# Altium schematic sheet Display.SchDoc: 7-SEGMENT DISPLAY & DRIVER
size A4; SheetNumber: 2; SheetTotal: 5; DOC_NO_SCH_DWG: #032024040601
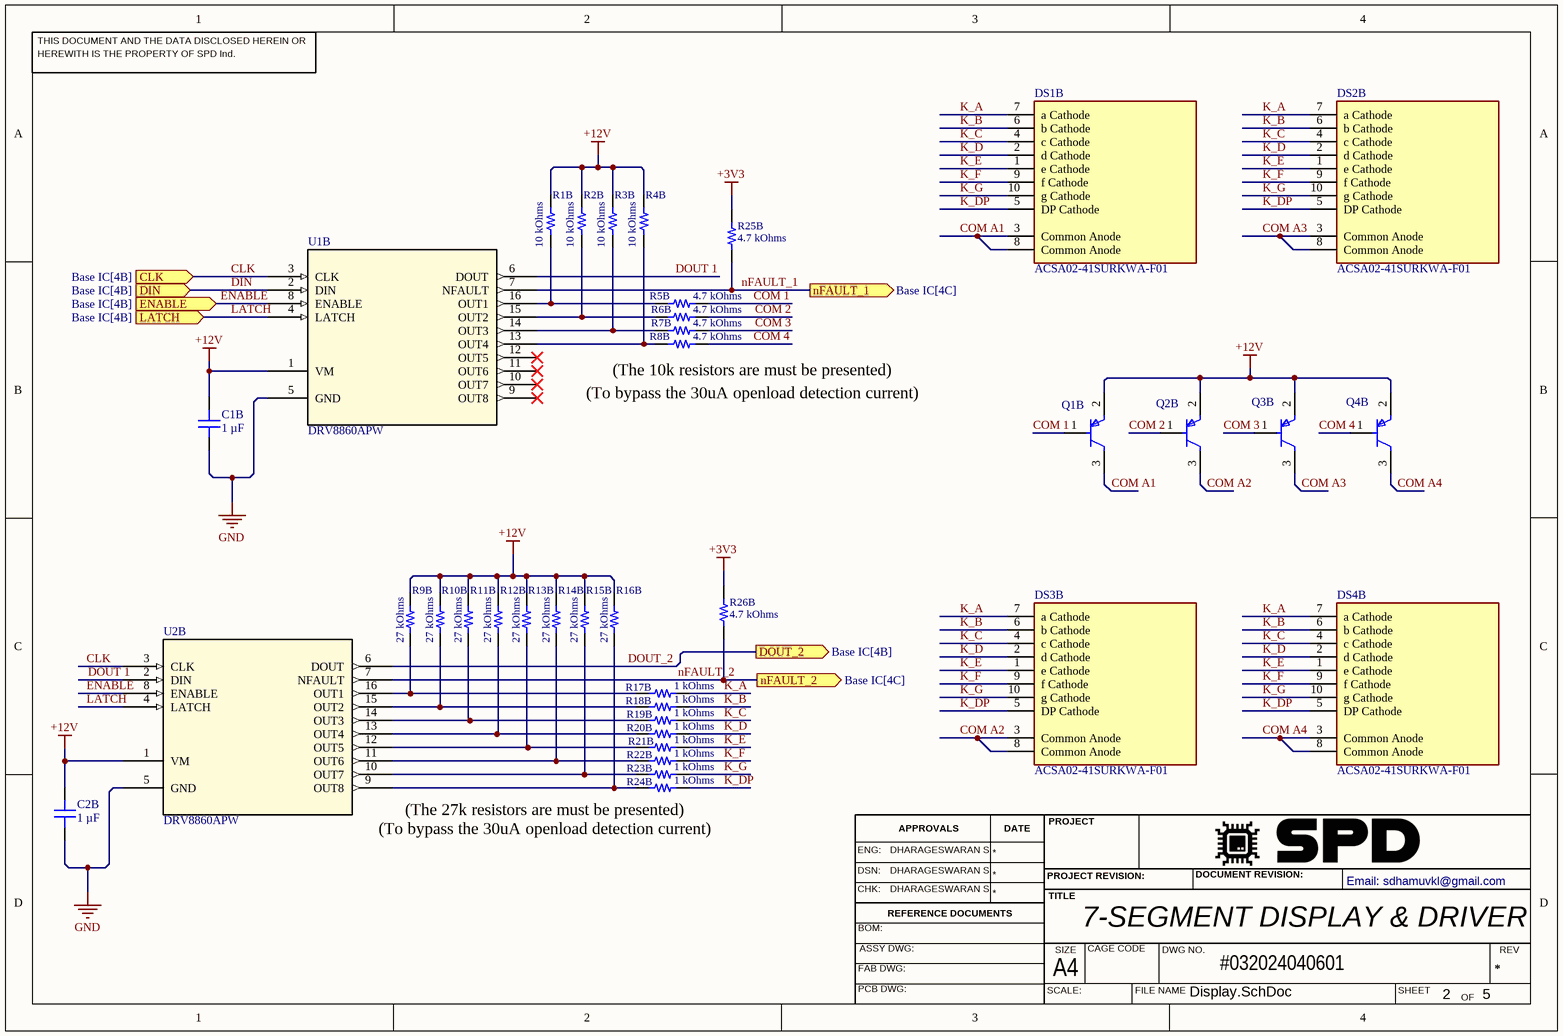
[diagram p0: Display.SchDoc]

## Parts
C1B  1 µF  [CAP 0402_1005]
C2B  1 µF  [CAP 0402_1005]
DS1B  ACSA02-41SURKWA-F01  [FP-ACSA02-41SURKWA-F01-MFG]
DS2B  ACSA02-41SURKWA-F01  [FP-ACSA02-41SURKWA-F01-MFG]
DS3B  ACSA02-41SURKWA-F01  [FP-ACSA02-41SURKWA-F01-MFG]
DS4B  ACSA02-41SURKWA-F01  [FP-ACSA02-41SURKWA-F01-MFG]
Q1B  MMBT3906FZ-7B  [FP-X2-DFN0606-3-MFG]  (value not drawn)
Q2B  MMBT3906FZ-7B  [FP-X2-DFN0606-3-MFG]  (value not drawn)
Q3B  MMBT3906FZ-7B  [FP-X2-DFN0606-3-MFG]  (value not drawn)
Q4B  MMBT3906FZ-7B  [FP-X2-DFN0606-3-MFG]  (value not drawn)
R1B  10 kOhms  [RES 0402_1005]
R2B  10 kOhms  [RES 0402_1005]
R3B  10 kOhms  [RES 0402_1005]
R4B  10 kOhms  [RES 0402_1005]
R5B  4.7 kOhms  [RES 0402_1005]
R6B  4.7 kOhms  [RES 0402_1005]
R7B  4.7 kOhms  [RES 0402_1005]
R8B  4.7 kOhms  [RES 0402_1005]
R9B  27 kOhms  [RES 0402_1005]
R10B  27 kOhms  [RES 0402_1005]
R11B  27 kOhms  [RES 0402_1005]
R12B  27 kOhms  [RES 0402_1005]
R13B  27 kOhms  [RES 0402_1005]
R14B  27 kOhms  [RES 0402_1005]
R15B  27 kOhms  [RES 0402_1005]
R16B  27 kOhms  [RES 0402_1005]
R17B  1 kOhms  [RES 0402_1005]
R18B  1 kOhms  [RES 0402_1005]
R19B  1 kOhms  [RES 0402_1005]
R20B  1 kOhms  [RES 0402_1005]
R21B  1 kOhms  [RES 0402_1005]
R22B  1 kOhms  [RES 0402_1005]
R23B  1 kOhms  [RES 0402_1005]
R24B  1 kOhms  [RES 0402_1005]
R25B  4.7 kOhms  [RES 0402_1005]
R26B  4.7 kOhms  [RES 0402_1005]
U1B  DRV8860APW  [PW_16]
U2B  DRV8860APW  [PW_16]

## Ports
CLK (in, see Base IC[4B]), DIN (in, see Base IC[4B]), DOUT_2 (out, see Base IC[4B]), ENABLE (in, see Base IC[4B]), LATCH (in, see Base IC[4B]), nFAULT_1 (out, see Base IC[4C]), nFAULT_2 (out, see Base IC[4C])

## Nets
+3V3: R25B.2 R26B.2
+12V: C1B.1 C2B.1 Q1B.2(E) Q2B.2(E) Q3B.2(E) Q4B.2(E) R1B.2 R2B.2 R3B.2 R4B.2 R9B.2 R10B.2 R11B.2 R12B.2 R13B.2 R14B.2 R15B.2 R16B.2 U1B.1(VM) U2B.1(VM)
GND: C1B.2 C2B.2 U1B.5(GND) U2B.5(GND)
CLK: U1B.3(CLK) U2B.3(CLK) ; port CLK
COM 1: Q1B.1(B) R5B.2
COM 2: Q2B.1(B) R6B.2
COM 3: Q3B.1(B) R7B.2
COM 4: Q4B.1(B) R8B.2
COM A1: DS1B.3(Common_Anode) DS1B.8(Common_Anode) Q1B.3(C)
COM A2: DS3B.3(Common_Anode) DS3B.8(Common_Anode) Q2B.3(C)
COM A3: DS2B.3(Common_Anode) DS2B.8(Common_Anode) Q3B.3(C)
COM A4: DS4B.3(Common_Anode) DS4B.8(Common_Anode) Q4B.3(C)
DIN: U1B.2(DIN) ; port DIN
DOUT 1: U1B.6(DOUT) U2B.2(DIN)
DOUT_2: U2B.6(DOUT) ; port DOUT_2
ENABLE: U1B.8(ENABLE) U2B.8(ENABLE) ; port ENABLE
K_A: DS1B.7(a_Cathode) DS2B.7(a_Cathode) DS3B.7(a_Cathode) DS4B.7(a_Cathode) R17B.2
K_B: DS1B.6(b_Cathode) DS2B.6(b_Cathode) DS3B.6(b_Cathode) DS4B.6(b_Cathode) R18B.2
K_C: DS1B.4(c_Cathode) DS2B.4(c_Cathode) DS3B.4(c_Cathode) DS4B.4(c_Cathode) R19B.2
K_D: DS1B.2(d_Cathode) DS2B.2(d_Cathode) DS3B.2(d_Cathode) DS4B.2(d_Cathode) R20B.2
K_DP: DS1B.5(DP_Cathode) DS2B.5(DP_Cathode) DS3B.5(DP_Cathode) DS4B.5(DP_Cathode) R24B.2
K_E: DS1B.1(e_Cathode) DS2B.1(e_Cathode) DS3B.1(e_Cathode) DS4B.1(e_Cathode) R21B.2
K_F: DS1B.9(f_Cathode) DS2B.9(f_Cathode) DS3B.9(f_Cathode) DS4B.9(f_Cathode) R22B.2
K_G: DS1B.10(g_Cathode) DS2B.10(g_Cathode) DS3B.10(g_Cathode) DS4B.10(g_Cathode) R23B.2
LATCH: U1B.4(LATCH) U2B.4(LATCH) ; port LATCH
nFAULT_1: R25B.1 U1B.7(NFAULT) ; port nFAULT_1
nFAULT_2: R26B.1 U2B.7(NFAULT) ; port nFAULT_2
NetR1B_1: R1B.1 R5B.1 U1B.16(OUT1)
NetR2B_1: R2B.1 R6B.1 U1B.15(OUT2)
NetR3B_1: R3B.1 R7B.1 U1B.14(OUT3)
NetR4B_1: R4B.1 R8B.1 U1B.13(OUT4)
NetR9B_1: R9B.1 R17B.1 U2B.16(OUT1)
NetR10B_1: R10B.1 R18B.1 U2B.15(OUT2)
NetR11B_1: R11B.1 R19B.1 U2B.14(OUT3)
NetR12B_1: R12B.1 R20B.1 U2B.13(OUT4)
NetR13B_1: R13B.1 R21B.1 U2B.12(OUT5)
NetR14B_1: R14B.1 R22B.1 U2B.11(OUT6)
NetR15B_1: R15B.1 R23B.1 U2B.10(OUT7)
NetR16B_1: R16B.1 R24B.1 U2B.9(OUT8)

Not connected (* = marked no-connect by the designer): U1B 9(OUT8)* 10(OUT7)* 11(OUT6)* 12(OUT5)*

## Notes on the sheet
- (near R8B) (The 10k resistors are must be presented)
- (To bypass the 30uA openload detection current)
- (near R24B) (The 27k resistors are must be presented)
- THIS DOCUMENT AND THE DATA DISCLOSED HEREIN OR
- HEREWITH IS THE PROPERTY OF SPD Ind.
- ENG:
- DHARAGESWARAN S
- APPROVALS
- DATE
- PROJECT
- DSN:
- CHK:
- REFERENCE DOCUMENTS
- PROJECT REVISION:
- TITLE
- DOCUMENT REVISION:
- Email: sdhamuvkl@gmail.com <https://github.com/DhamuVkl>
- BOM:
- FAB DWG:
- PCB DWG:
- ASSY DWG:
- SCALE:
- A4
- SIZE
- CAGE CODE
- FILE NAME
- DWG NO.
- SHEET
- REV
- OF

## Library data of the parts
C1B C2B = GRM155C81C105KE15J: CAP CER MLCC; Manufacturer: Murata Electronics; id: 7124; Temperature Coefficient: X6S; Tolerance: ±10%; Voltage - Rated: 16V; Part Number: GRM155C81C105KE15J; Value: 1 µF; Supplier Part Number 1: 490-GRM155C81C105KE15JCT-ND; ComponentLink2Description: DigiKey Link; PartId: 54559; Supplier 1: DigiKey; Series: GRM; LastUpdated: 2023-06-29T19:02:33.680; Part Status: Active; Capacitance: 1 µF; Device Package: 0402 (1005 Metric); Thickness (Max): 0.022" (0.55mm); Minimum Order: 1; Packaging: CutTape; Applications: General Purpose; Package / Case: 0402 (1005 Metric); Price: 0.01; ComponentLink2URL: https://www.digikey.com/en/products/detail/murata-electronics/GRM155C81C105KE15J/10697200; Lifecycle Status: Active; Operating Temperature: -55°C ~ 105°C; Size / Dimension: 0.039" L x 0.020" W (1.00mm x 0.50mm); Mounting Type: Surface Mount, MLCC
DS1B DS2B DS3B DS4B = CMP-44525-000003-1: DISPLAY 7-SEG 0.2" SGL RED 10SMD; Element Configuration: Common Anode; Forward Current: 30mA; Wavelength: 630nm; Operating Supply Voltage: 1.95V; Number of Characters: 1; Max Power Dissipation: 75mW; Luminous Intensity: 30mcd; Test Current: 20mA; Package Quantity: 650; Width: 0.272inch; Max Operating Temperature: 85°C; Case/Package: SMD/SMT; Illumination Color: Red; Min Operating Temperature: -40°C; Packaging: Tape and Reel; Power Consumption: 75mW; Forward Voltage: 1.95V; Color: Red; Height: 0.315inch
Q1B Q2B Q3B Q4B = CMP-12798-000043-1: TRANS PNP 40V 0.2A X2-DFN060; Continuous Collector Current: -200mA; Gain Bandwidth Product: 250MHz; Collector Base Voltage (VCBO): -40V; Emitter Base Voltage (VEBO): -6V; Element Configuration: Single; hFE Min: 100; Max Power Dissipation: 435mW; Collector Emitter Voltage (VCEO): 400mV; Collector Emitter Saturation Voltage: -400mV; Transition Frequency: 280MHz; Max Collector Current: 200mA; Mount: Surface Mount; Polarity: PNP; Min Operating Temperature: -55°C; Max Operating Temperature: 150°C; Package Quantity: 10000; Max Breakdown Voltage: 40V; Collector Emitter Breakdown Voltage: 40V; Packaging: Tape and Reel; Number of Pins: 3
R1B R2B R3B R4B = AA0402FR-0710KL: RES SMD 10K OHM 1% 1/16W 0402; Manufacturer: Yageo; id: 10610; Temperature Coefficient: ±150ppm/°C; Power (Watts): 0.063W, 1/16W; Part Number: AA0402FR-0710KL; Height - Seated (Max): 0.015" (0.37mm); Supplier Part Number 1: 13-AA0402FR-0710KLCT-ND; Supplier Device Package: 0402; ComponentLink1Description: Datasheet; ComponentLink2URL: https://www.digikey.com/en/products/detail/yageo/AA0402FR-0710KL/5887729; Features: Anti-Sulfur, Automotive AEC-Q200, Moisture Resistant; ComponentLink1URL: https://www.yageo.com/upload/media/product/productsearch/datasheet/rchip/PYu-AA_51_RoHS_L_3.pdf; Composition: Thick Film; Tolerance: ±1%; Supplier 1: DigiKey; Series: AA; Part Status: Active; ComponentLink2Description: DigiKey Link; Device Package: 0402 (1005 Metric); Packaging: TapeAndReel; Ratings: AEC-Q200; Minimum Order: 1; Package / Case: 0402 (1005 Metric); PartId: 59190; Lifecycle Status: Active; LastUpdated: 2023-01-02T20:20:10.303; Operating Temperature: -55°C ~ 155°C; Number Of Terminations: 2; Value: 10 kOhms; Size / Dimension: 0.039" L x 0.020" W (1.00mm x 0.50mm); Price: 0.01; Resistance: 10 kOhms
R5B R6B R7B R8B R25B R26B = AC0402FR-074K7L: RES SMD 4.7K OHM 1% 1/16W 0402; Manufacturer: Yageo; id: 4996; Temperature Coefficient: ±100ppm/°C; Power (Watts): 0.063W, 1/16W; Part Number: AC0402FR-074K7L; Height - Seated (Max): 0.015" (0.37mm); Supplier Part Number 1: YAG3497CT-ND; Supplier Device Package: 0402; ComponentLink1Description: Datasheet; ComponentLink2URL: https://www.digikey.com/en/products/detail/yageo/AC0402FR-074K7L/5895396; Features: Automotive AEC-Q200, Moisture Resistant; ComponentLink1URL: https://www.yageo.com/upload/media/product/productsearch/datasheet/rchip/PYu-AC_51_RoHS_L_7.pdf; Composition: Thick Film; Tolerance: ±1%; Supplier 1: DigiKey; Series: AC; Part Status: Active; ComponentLink2Description: DigiKey Link; Device Package: 0402 (1005 Metric); Packaging: CutTape; Ratings: AEC-Q200; Minimum Order: 1; Package / Case: 0402 (1005 Metric); PartId: 12051; Lifecycle Status: Active; LastUpdated: 2023-01-02T20:21:09.847; Operating Temperature: -55°C ~ 155°C; Number Of Terminations: 2; Value: 4.7 kOhms; Size / Dimension: 0.039" L x 0.020" W (1.00mm x 0.50mm); Price: 0.01; Resistance: 4.7 kOhms
R9B R10B R11B R12B R13B R14B R15B R16B = AC0402FR-0727KL: RES SMD 27K OHM 1% 1/16W 0402; Manufacturer: Yageo; id: 5006; Temperature Coefficient: ±100ppm/°C; Power (Watts): 0.063W, 1/16W; Part Number: AC0402FR-0727KL; Height - Seated (Max): 0.015" (0.37mm); Supplier Part Number 1: YAG3466CT-ND; Supplier Device Package: 0402; ComponentLink1Description: Datasheet; ComponentLink2URL: https://www.digikey.com/en/products/detail/yageo/AC0402FR-0727KL/5895228; Features: Automotive AEC-Q200, Moisture Resistant; ComponentLink1URL: https://www.yageo.com/upload/media/product/productsearch/datasheet/rchip/PYu-AC_51_RoHS_L_7.pdf; Composition: Thick Film; Tolerance: ±1%; Supplier 1: DigiKey; Series: AC; Part Status: Active; ComponentLink2Description: DigiKey Link; Device Package: 0402 (1005 Metric); Packaging: CutTape; Ratings: AEC-Q200; Minimum Order: 1; Package / Case: 0402 (1005 Metric); PartId: 12068; Lifecycle Status: Active; LastUpdated: 2023-01-02T20:21:09.767; Operating Temperature: -55°C ~ 155°C; Number Of Terminations: 2; Value: 27 kOhms; Size / Dimension: 0.039" L x 0.020" W (1.00mm x 0.50mm); Price: 0.01; Resistance: 27 kOhms
R17B R18B R19B R20B R21B R22B R23B R24B = AA0402FR-071KL: RES SMD 1K OHM 1% 1/16W 0402; Manufacturer: Yageo; id: 10598; Temperature Coefficient: ±150ppm/°C; Power (Watts): 0.063W, 1/16W; Part Number: AA0402FR-071KL; Height - Seated (Max): 0.015" (0.37mm); Supplier Part Number 1: 13-AA0402FR-071KLCT-ND; Supplier Device Package: 0402; ComponentLink1Description: Datasheet; ComponentLink2URL: https://www.digikey.com/en/products/detail/yageo/AA0402FR-071KL/5887878; Features: Anti-Sulfur, Automotive AEC-Q200, Moisture Resistant; ComponentLink1URL: https://www.yageo.com/upload/media/product/productsearch/datasheet/rchip/PYu-AA_51_RoHS_L_3.pdf; Composition: Thick Film; Tolerance: ±1%; Supplier 1: DigiKey; Series: AA; Part Status: Active; ComponentLink2Description: DigiKey Link; Device Package: 0402 (1005 Metric); Packaging: TapeAndReel; Ratings: AEC-Q200; Minimum Order: 1; Package / Case: 0402 (1005 Metric); PartId: 59178; Lifecycle Status: Active; LastUpdated: 2023-01-02T20:20:10.210; Operating Temperature: -55°C ~ 155°C; Number Of Terminations: 2; Value: 1 kOhms; Size / Dimension: 0.039" L x 0.020" W (1.00mm x 0.50mm); Price: 0.01; Resistance: 1 kOhms
U1B U2B = DRV8860APW: No Description Available; Mfr_Name: Texas Instruments; RefDes: RefDes; Type: Type; Supplier 1: Mouser; Supplier Part Number 1: 595-DRV8860APWR